# EAGLE board MotorPR (EAGLE 7.6.0)
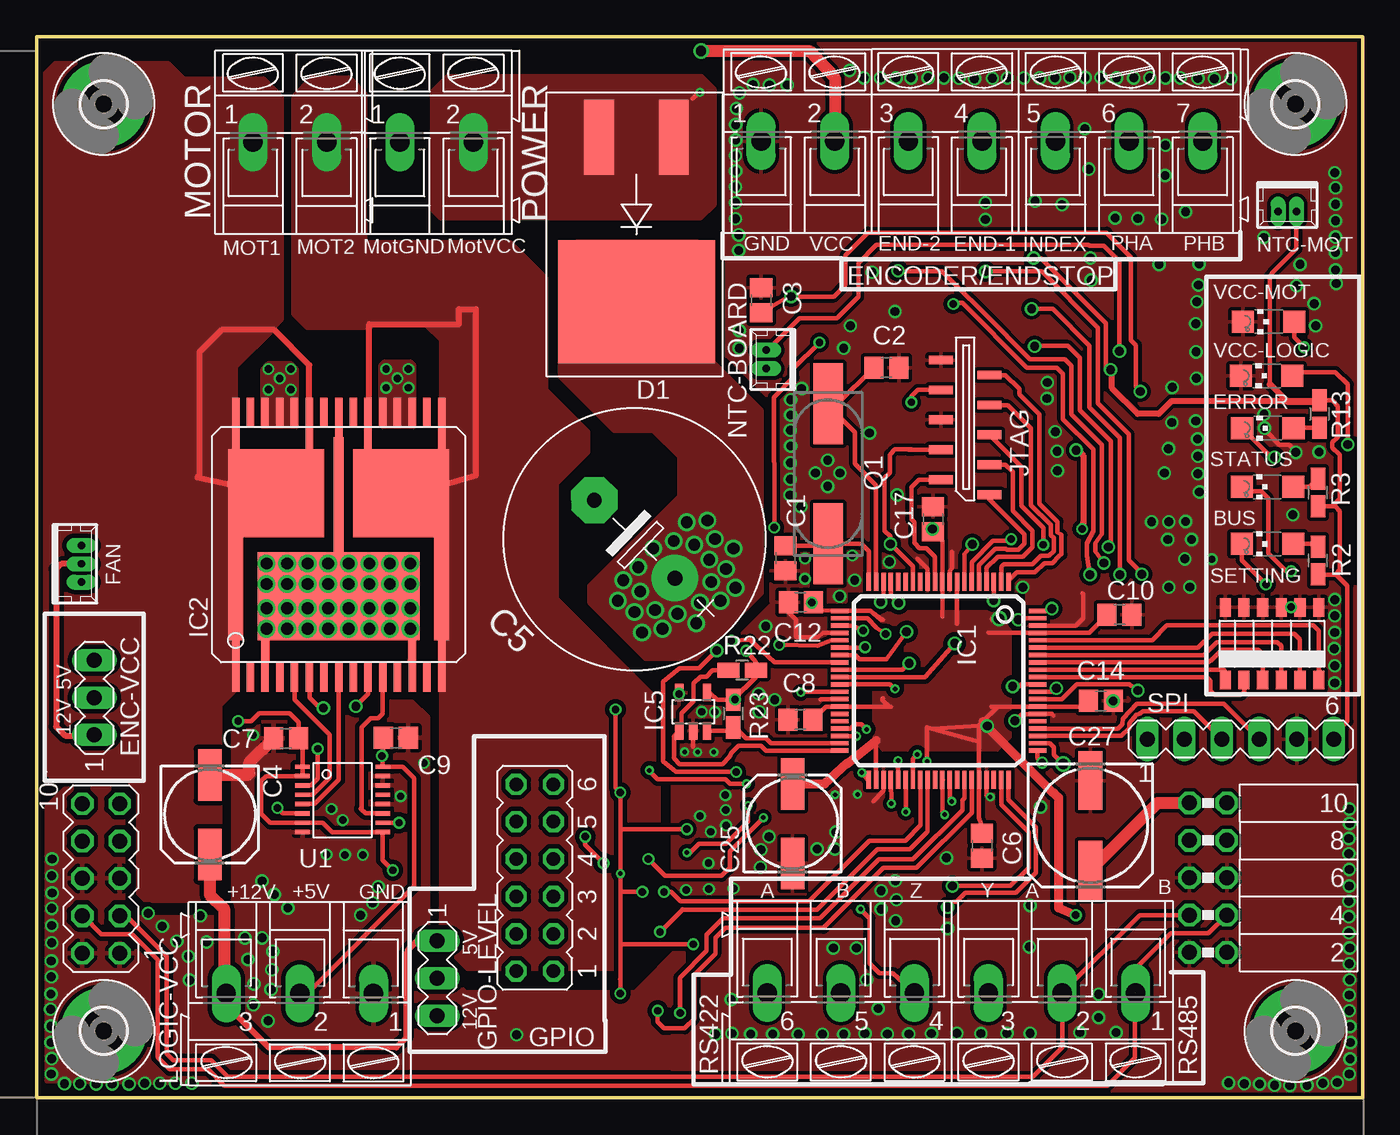
[diagram p6: board, top side]
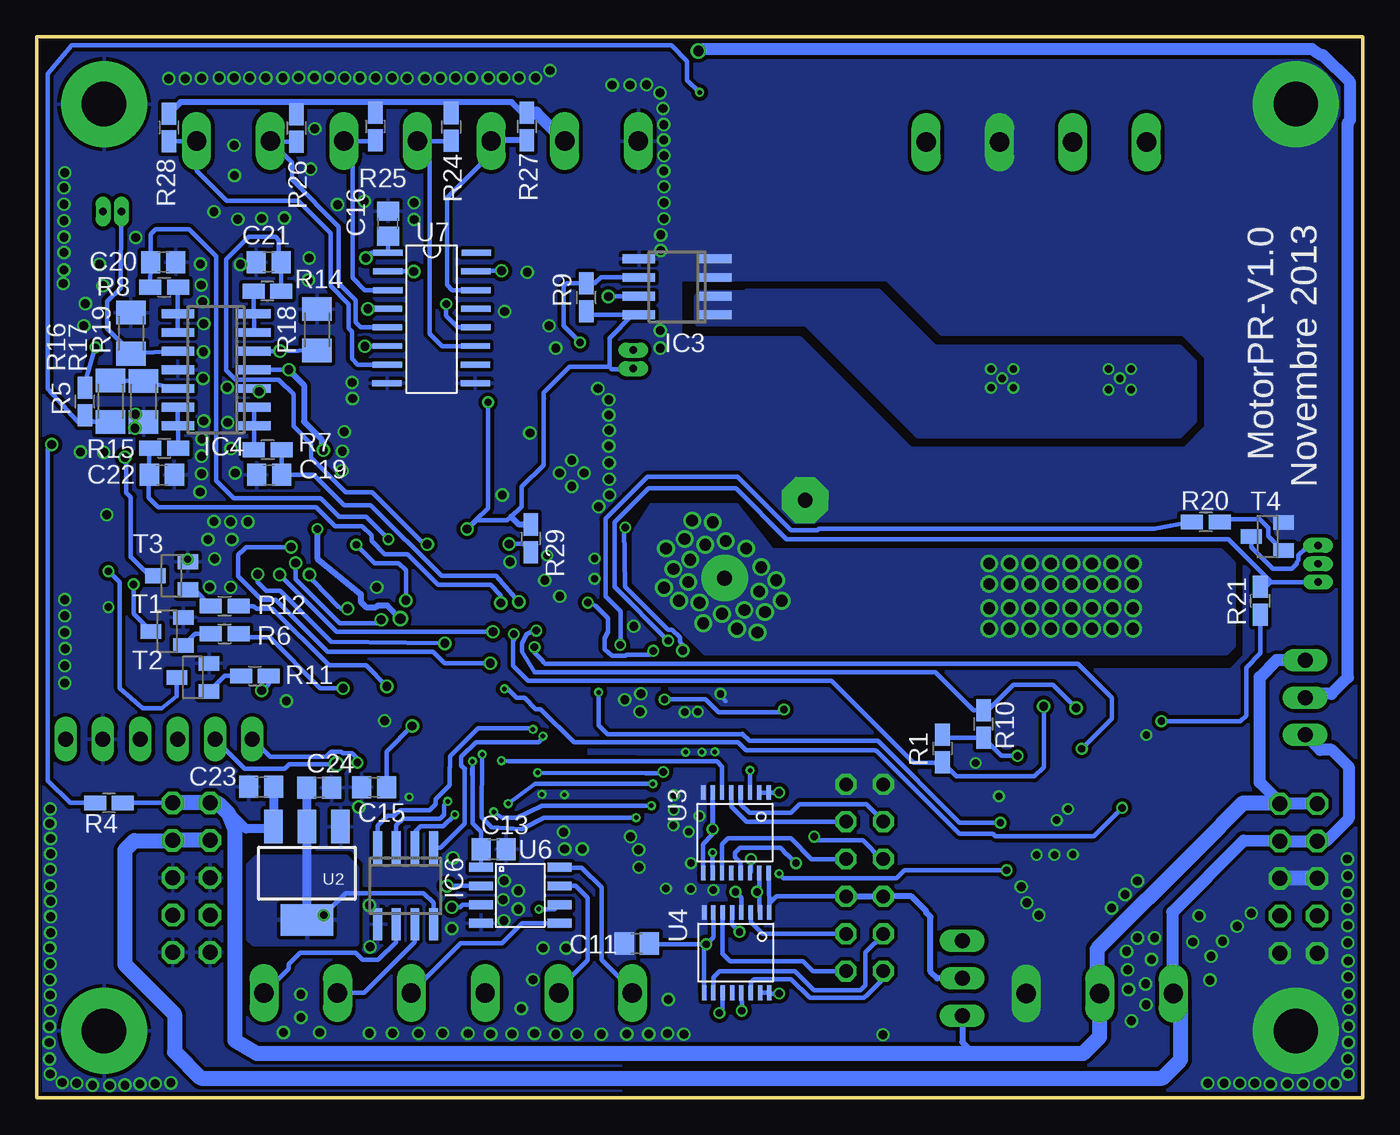
[diagram p7: board, bottom side, seen from below]

Size 90.14 x 72.11 mm. Coordinates in mm from the lower left corner, seen from the top.
Outline: 0,0 90.14,0 90.14,72.11 0,72.11 0,0
Copper layers (1*16): Top 0.035mm / dielectric 1.5mm / Bottom 0.035mm
Design rules "default": minimum track width 6mil, minimum drill 12mil, track to track 6mil, track to pad 6mil, pad to pad 6mil, via to via 6mil, smd to smd 0mil, copper to edge 10mil, drill to drill 10mil, minimum pad ring 10mil, minimum via ring 6mil, stop-mask expansion 2mil, vias tented up to drill 100mil, thermal gap 10mil

## Footprints (pad centres in the part's own frame; a part is rotated, then mirrored left to right if it is on the bottom)
MA05-2 = drill 1.016 octagon: 1 -5.08,-1.27; 2 -5.08,1.27; 3 -2.54,-1.27; 4 -2.54,1.27; 5 0,-1.27; 6 0,1.27; 7 2.54,-1.27; 8 2.54,1.27; 9 5.08,-1.27; 10 5.08,1.27
FE05-2W = drill 1.016 octagon: 1 -5.08,1.27; 2 -5.08,-1.27; 3 -2.54,1.27; 4 -2.54,-1.27; 5 0,1.27; 6 0,-1.27; 7 2.54,1.27; 8 2.54,-1.27; 9 5.08,1.27; 10 5.08,-1.27
CHIPLED_1206 = smd 1.5 x 1.5: A 0,-1.75; C 0,1.75
C0805 = smd 1.3 x 1.5: 1 -0.85,0; 2 0.85,0
153CLV-0605 = smd 3.5 x 1.6: + 2.7,0; - -2.7,0
E7,5-18 = drill 1.016 pad 3.15: + -3.81,0 | drill 1.016 pad 3.15 octagon: - 3.81,0
153CLV-0807 = smd 4 x 1.6: + 3.05,0; - -3.05,0
TO-263AB = smd 2.032 x 5.08: A1 -2.54,-3.556; A2 2.54,-3.556 | smd 10.668 x 8.382: K 0,7.62
MA03-1 = drill 1.016 long: 1 -2.54,0; 2 0,0; 3 2.54,0
AK300/7 = drill 1.321 long: 1 -15.011,0; 2 -10.008,0; 3 -5.004,0; 4 0,0; 5 5.004,0; 6 10.008,0; 7 15.011,0
53047-03 = drill 0.5 pad 0.698 long: 1 1.25,0.45; 2 0,0.45; 3 -1.25,0.45
JP6Q = drill 0.914 octagon: 1 -6.35,-1.27; 2 -6.35,1.27; 3 -3.81,-1.27; 4 -3.81,1.27; 5 -1.27,-1.27; 6 -1.27,1.27; 7 1.27,-1.27; 8 1.27,1.27; 9 3.81,-1.27; 10 3.81,1.27; 11 6.35,-1.27; 12 6.35,1.27
3,0-PAD = drill 3 pad 5.842: B3,0 0,0
LQFP80-12X12 = smd 1.2 x 0.3: 1 -6.725,4.75; 2 -6.725,4.25; 3 -6.725,3.75; 4 -6.725,3.25; 5 -6.725,2.75; 6 -6.725,2.25; 7 -6.725,1.75; 8 -6.725,1.25; 9 -6.725,0.75; 10 -6.725,0.25; 11 -6.725,-0.25; 12 -6.725,-0.75; 13 -6.725,-1.25; 14 -6.725,-1.75; 15 -6.725,-2.25; 16 -6.725,-2.75; 17 -6.725,-3.25; 18 -6.725,-3.75; 19 -6.725,-4.25; 20 -6.725,-4.75; 41 6.725,-4.75; 42 6.725,-4.25; 43 6.725,-3.75; 44 6.725,-3.25; 45 6.725,-2.75; 46 6.725,-2.25; 47 6.725,-1.75; 48 6.725,-1.25; 49 6.725,-0.75; 50 6.725,-0.25; 51 6.725,0.25; 52 6.725,0.75; 53 6.725,1.25; 54 6.725,1.75; 55 6.725,2.25; 56 6.725,2.75; 57 6.725,3.25; 58 6.725,3.75; 59 6.725,4.25; 60 6.725,4.75 | smd 0.3 x 1.2: 21 -4.75,-6.725; 22 -4.25,-6.725; 23 -3.75,-6.725; 24 -3.25,-6.725; 25 -2.75,-6.725; 26 -2.25,-6.725; 27 -1.75,-6.725; 28 -1.25,-6.725; 29 -0.75,-6.725; 30 -0.25,-6.725; 31 0.25,-6.725; 32 0.75,-6.725; 33 1.25,-6.725; 34 1.75,-6.725; 35 2.25,-6.725; 36 2.75,-6.725; 37 3.25,-6.725; 38 3.75,-6.725; 39 4.25,-6.725; 40 4.75,-6.725; 61 4.75,6.725; 62 4.25,6.725; 63 3.75,6.725; 64 3.25,6.725; 65 2.75,6.725; 66 2.25,6.725; 67 1.75,6.725; 68 1.25,6.725; 69 0.75,6.725; 70 0.25,6.725; 71 -0.25,6.725; 72 -0.75,6.725; 73 -1.25,6.725; 74 -1.75,6.725; 75 -2.25,6.725; 76 -2.75,6.725; 77 -3.25,6.725; 78 -3.75,6.725; 79 -4.25,6.725; 80 -4.75,6.725
MULTIPOWERSO-30 = smd 0.508 x 12: 1 -7,-4; 15 7,-4; 16 7,4; 30 -7,4 | smd 0.508 x 2: 2 -6,-9; 4 -4,-9; 5 -3,-9; 6 -2,-9; 7 -1,-9; 8 0,-9; 9 1,-9; 10 2,-9; 11 3,-9; 12 4,-9; 14 6,-9; 17 6,9; 18 5,9; 19 4,9; 20 3,9; 22 1,9; 24 -1,9; 26 -3,9; 27 -4,9; 28 -5,9; 29 -6,9 | smd 0.508 x 4: 3 -5,-8; 13 5,-8; 21 2,8; 23 0,8; 25 -2,8 | smd 6.5 x 6: OUTA -4.25,3.5; OUTB 4.25,3.5 | smd 1 x 7.5: OUTA@1 -7,-2.755; OUTB@1 7,-2.755 | smd 11 x 6: VCC 0,-3.5 | smd 0.65 x 8.3: VCC@1 0,3.145
SO08 = smd 0.6 x 2.2: 1 -1.905,-2.6; 2 -0.635,-2.6; 3 0.635,-2.6; 4 1.905,-2.6; 5 1.905,2.6; 6 0.635,2.6; 7 -0.635,2.6; 8 -1.905,2.6
SO14 = smd 0.6 x 2.2: 1 -3.81,-2.6; 2 -2.54,-2.6; 3 -1.27,-2.6; 4 0,-2.6; 5 1.27,-2.6; 6 2.54,-2.6; 7 3.81,-2.6; 8 3.81,2.6; 9 2.54,2.6; 10 1.27,2.6; 11 0,2.6; 12 -1.27,2.6; 13 -2.54,2.6; 14 -3.81,2.6
SOT23-5L = smd 0.55 x 1.2: 1 -0.95,-1.3; 2 0,-1.3; 3 0.95,-1.3; 4 0.95,1.3; 5 -0.95,1.3
SOIC8 = smd 0.6 x 2.2: 1 -1.905,-2.6; 2 -0.635,-2.6; 3 0.635,-2.6; 4 1.905,-2.6; 5 1.905,2.6; 6 0.635,2.6; 7 -0.635,2.6; 8 -1.905,2.6
MOLEX-52808-1070 = smd 0.6 x 1.65: 1 0,-1.524; 2 1.016,1.778; 3 2.032,-1.524; 4 3.048,1.778; 5 4.064,-1.524; 6 5.08,1.778; 7 6.096,-1.524; 8 7.112,1.778; 9 8.128,-1.524; 10 9.144,1.778
AK300/3 = drill 1.321 long: 1 -5.004,0; 2 0,0; 3 5.004,0
AK300/2 = drill 1.321 long: 1 -2.515,0; 2 2.489,0
53047-02 = drill 0.5 pad 0.698 long: 1 0.625,0.45; 2 -0.625,0.45
CSM-7X-DU = smd 5.5 x 2: 1 -4.75,0; 2 4.75,0
R0805W = smd 1.5 x 1: 1 -0.94,0; 2 0.94,0
M1206 = smd 1.6 x 2: 1 -1.4,0; 2 1.4,0
AK300/6 = drill 1.321 long: 1 -12.522,0; 2 -7.518,0; 3 -2.515,0; 4 2.515,0; 5 7.518,0; 6 12.522,0
DIP6-SMD = smd 1.27 x 0.76: 1 -2.159,3.175; 2 -2.159,1.905; 3 -2.159,0.635; 4 -2.159,-0.635; 5 -2.159,-1.905; 6 -2.159,-3.175; 7 2.759,-3.175; 8 2.759,-1.905; 9 2.759,-0.635; 10 2.759,0.635; 11 2.759,1.905; 12 2.759,3.175
MA06-1 = drill 1.016 long: 1 -6.35,0; 2 -3.81,0; 3 -1.27,0; 4 1.27,0; 5 3.81,0; 6 6.35,0
SOT23-BEC = smd 1 x 1.4: B -0.95,-1.1; C 0,1.1; E 0.95,-1.1
PW-PDSO-G16 = smd 0.3 x 1: 1 -2.159,-2.667; 2 -1.524,-2.667; 3 -0.889,-2.667; 4 -0.254,-2.667; 5 0.381,-2.667; 6 1.016,-2.667; 7 1.651,-2.667; 8 2.286,-2.667; 9 2.286,2.794; 10 1.651,2.794; 11 1.016,2.794; 12 0.381,2.794; 13 -0.254,2.794; 14 -0.889,2.794; 15 -1.524,2.794; 16 -2.159,2.794
SOT-223 = smd 1.27 x 2.286: 1 -2.286,-3.175; 2 0,-3.175; 3 2.286,-3.175 | smd 3.556 x 2.159: TER 0,3.175
R-PDSO-G8 = smd 0.6 x 1.65: 1 -2.032,-2.794; 2 -0.762,-2.794; 3 0.508,-2.794; 4 1.778,-2.794; 5 1.778,2.54; 6 0.508,2.54; 7 -0.762,2.54; 8 -2.032,2.54
PDSO-G16 = smd 2 x 0.4: 1 -3,4.5; 2 -3.01,3.23; 3 -3.01,1.96; 4 -3.02,0.69; 5 -3.03,-0.57; 6 -3.04,-1.84; 7 -3.05,-3.11; 8 -3.06,-4.38; 9 2.94,-4.38; 10 2.95,-3.11; 11 2.96,-1.84; 12 2.97,-0.57; 13 2.98,0.69; 14 2.99,1.96; 15 2.99,3.23; 16 3,4.5

## Placement (x,y rotation side)
B-B-L  [MA05-2]  4.37,14.91 90 top
B-B-R  [FE05-2W]  79.63,14.96 90 top
BUS  [CHIPLED_1206]  83.67,37.64 90 top
C1  22p  [C0805]  50.9,36.68 270 top
C2  22p  [C0805]  57.76,49.63 0 top
C3  10n  [C0805]  49.25,54.2 90 top
C4  22uF 16V  [153CLV-0605]  11.76,19.25 270 top
C5  1000uF 35V  [E7,5-18]  40.64,37.97 135.9 top
C6  100n  [C0805]  64.26,17.14 270 top
C7  100n  [C0805]  16.94,24.43 180 top
C8  100n  [C0805]  51.92,25.7 180 top
C9  100n  [C0805]  24.41,24.46 0 top
C10  100n  [C0805]  73.61,32.84 0 top
C11  100n  [C0805]  49.35,10.49 180 bottom
C12  100n  [C0805]  51.94,33.68 180 top
C13  100n  [C0805]  59.08,16.89 0 bottom
C14  100n  [C0805]  72.34,26.97 0 top
C15  100n  [C0805]  67.21,21.11 180 bottom
C16  100n  [C0805]  66.27,59.41 90 bottom
C17  100n  [C0805]  60.93,39.32 90 top
C19  100n  [C0805]  74.35,42.34 180 bottom
C20  1uF  [C0805]  81.56,56.79 0 bottom
C21  1uF  [C0805]  74.37,56.79 180 bottom
C22  1uF  [C0805]  81.64,42.34 0 bottom
C23  100n  [C0805]  74.88,21.13 180 bottom
C24  100n  [C0805]  70.94,21.08 0 bottom
C25  22uF 16V  [153CLV-0605]  51.38,18.64 90 top
C27  100uF 25V  [153CLV-0807]  71.63,18.52 270 top
D1  VBT4045BP  [TO-263AB]  40.77,61.72 180 top
ENC-VCC  [MA03-1]  3.91,27.2 90 top
ENCODER/ENDSTOP  [AK300/7]  64.26,65.02 0 top
ERROR  [CHIPLED_1206]  83.69,45.52 90 top
FAN  53047-03  [53047-03]  2.59,36.3 270 top
GPIO  [JP6Q]  33.86,14.96 90 top
GPIO-LEVEL  [MA03-1]  27.23,8.13 270 top
H1  [3,0-PAD]  4.55,4.55 0 top
H2  [3,0-PAD]  85.57,4.55 0 top
H3  [3,0-PAD]  85.57,67.54 0 top
H4  [3,0-PAD]  4.55,67.54 0 top
IC1  LPC1751  [LQFP80-12X12]  61.32,28.35 270 top
IC2  VNH3SP30  [MULTIPOWERSO-30]  20.52,37.59 0 top
IC3  ACS711ELCTR-25AB-T  [SO08]  46.61,55.12 90 bottom
IC4  LM324D  [SO14]  77.95,49.48 90 bottom
IC5  24LC00OT  [SOT23-5L]  44.63,26.24 0 top
IC6  LTC485S  [SOIC8]  65.07,14.4 180 bottom
JTAG  MOLEX-52808-1070  [MOLEX-52808-1070]  63.25,41 90 top
LOGIC-VCC  [AK300/3]  17.88,7.09 180 top
MOTOR  [AK300/2]  17.22,64.95 0 top
NTC-BOARD  53047-02  [53047-02]  50.04,50.19 90 top
NTC-MOT  53047-02  [53047-02]  85.01,60.68 180 top
POWER  [AK300/2]  27.2,64.95 0 top
Q1  CSM-7X-DU  [CSM-7X-DU]  53.8,42.42 90 top
R1  10K  [R0805W]  28.57,23.75 270 bottom
R2  100  [R0805W]  87.1,36.53 90 top
R3  100  [R0805W]  87.1,41.15 90 top
R4  210  [R0805W]  85.24,20.04 180 bottom
R5  1.5K  [R0805W]  86.87,47.32 90 bottom
R6  12k  [R0805W]  77.37,31.55 0 bottom
R7  470  [R0805W]  74.45,44.04 180 bottom
R8  4,7k  [R0805W]  81.48,55.09 0 bottom
R9  4.7K  [R0805W]  52.78,54.41 90 bottom
R10  10K  [R0805W]  25.78,25.4 90 bottom
R11  12k  [R0805W]  75.31,28.68 0 bottom
R12  12k  [R0805W]  77.37,33.43 0 bottom
R13  100  [R0805W]  87.2,46.48 270 top
R14  4,7k  [R0805W]  74.47,54.81 180 bottom
R15  4,7k  [R0805W]  81.48,44.15 0 bottom
R16  10k  [M1206]  85.14,47.35 90 bottom
R17  1k  [M1206]  82.88,47.32 270 bottom
R18  4,7k  [M1206]  71.09,52.2 90 bottom
R19  4.7k  [M1206]  83.74,51.97 90 bottom
R20  10K  [R0805W]  10.67,39.14 180 bottom
R21  10K  [R0805W]  6.96,33.78 90 bottom
R22  4,7K  [R0805W]  47.96,29.06 180 top
R23  4,7K  [R0805W]  47.35,26.11 270 top
R24  10K  [R0805W]  61.98,65.99 270 bottom
R25  10K  [R0805W]  67.13,66.01 270 bottom
R26  10K  [R0805W]  72.49,65.91 270 bottom
R27  10K  [R0805W]  56.82,66.01 270 bottom
R28  10K  [R0805W]  81.15,65.94 270 bottom
R29  4,7k  [R0805W]  56.57,38.02 270 bottom
RS422  [AK300/6]  62.18,7.14 180 top
SETTING  SWS006  [DIP6-SMD]  83.97,31.17 270 top
SPI  [MA06-1]  81.84,24.38 0 top
STATUS  [CHIPLED_1206]  83.67,41.53 90 top
T1  [SOT23-BEC]  81.28,31.7 90 bottom
T2  [SOT23-BEC]  79.53,28.57 90 bottom
T3  [SOT23-BEC]  80.98,35.48 90 bottom
T4  [SOT23-BEC]  6.48,38.15 90 bottom
U1  CD40109B  [PW-PDSO-G16]  20.73,20.35 270 top
U2  AMS1117  [SOT-223]  71.78,15.27 180 bottom
U3  CD40109B  [PW-PDSO-G16]  42.55,18.08 180 bottom
U4  CD40109B  [PW-PDSO-G16]  42.49,9.93 180 bottom
U6  ISL83490IBZ  [R-PDSO-G8]  57.15,13.64 270 bottom
U7  MC14050B  [PDSO-G16]  63.27,52.93 0 bottom
VCC-LOGIC  [CHIPLED_1206]  83.62,49.07 90 top
VCC-MOT  [CHIPLED_1206]  83.74,52.76 90 top

## Tracks (layer width: path | path; a pad name or v marks a point on that pad's centre or on a via)
+3V3  (via drill 0.3, 0.5, 0.6, 0.7)
  Top 0.305: 52.79,33.15 IC1.21 56.59,33.1 | C8.1 53.66,26.6 IC1.34 56.14,26.6 57.25,26.59 57.96,26.59 | 56.59,33.1 | 56.59,33.1 56.69,33.1 | 56.69,33.1 57.53,32.49 57.33,32.59 57.38,32.54 | IC1.42 57.07,24.28 | 64.07,24.2 IC1.56 64.07,19.04 64.49,17.86 64.36,17.89 C6.1 | 64.07,24.2 60.85,25.08 | 60.85,25.08 60.53,25.2 v60.53,22.86 | 64.07,24.2 64.07,25.33 64.33,25.59 65.33,26.59 IC1.67 | IC1.67 64.89,26.6 | 64.69,31.6 IC1.77 71.55,31.6 72.8,32.84 | 56.69,33.1 57.4,32.49 | IC1.8 62.56,32.23 | 61.57,32.69 IC1.10 61.57,37.88 60.91,38.53 60.91,38.58 | 60.91,38.58 61.24,38.91 60.83,38.73 v60.88,38.66 | 60.91,38.58 60.88,38.56 | 72.8,32.84 72.8,32.79 | C10.1 72.8,32.84 | v64.62,25.27 64.03,25.27 60.85,25.08 | v67.77,57.07 68.28,57.07 72.69,52.65 72.69,49.66 v73,49.48 | C17.1 60.94,38.58 60.88,38.63 60.88,38.61 60.91,38.58 | 60.96,38.53 60.91,38.58 | IC5.4 45.74,27.54 46.23,27.05 R23.1 | R23.1 | R23.1 47.35,27.13 | R22.1 48.9,28.6 R23.1 | R23.1 47.35,27.08 48.9,28.63 48.9,29.62 v48.23,30.38 | v52.68,33.66 v52.68,33.67 C12.1 | NTC-MOT.2 85.64,57.7 83.97,56.03 83.97,55.98 83.82,55.83 83.82,48.49 85.06,47.24 87.02,47.24 R13.1 87.22,47.4 88.06,47.4 88.44,47.02 88.44,44.91 88.09,44.55 88.09,44.2 88.57,43.71 88.57,40.72 88.06,40.21 R3.1 88.27,40.21 88.59,39.88 88.59,35.89 88.27,35.56 | IC1.67 71.16,26.6 C14.1 | SPI.6 88.19,24.66 89.1,25.58 89.1,34.8 88.34,35.56 88.27,35.56 | 88.27,35.56 87.15,35.56 87.12,35.59 | 87.12,35.59 87.1,35.61 87.02,35.61 86.97,35.66 | R2.1 87.12,35.59 | 87.12,35.59 | 39.67,18.21 v39.67,20.75 39.34,21.08 v39.34,26.39 | 39.67,18.21 v39.67,15.24 39.67,13.99 | 39.67,13.99 39.67,10.54 | 39.67,10.54 39.67,8.1
  Top 0.305: 39.67,8.1 39.65,8.08 | v44.2,18.26 39.73,18.26 39.67,18.21 | 39.67,8.1 v39.67,7.09 | v44.63,10.44 39.78,10.44 39.67,10.54 | v41.17,13.99 39.67,13.99 | v13.69,25.6 14.58,25.6 15.11,26.14 17.2,26.14 17.8,25.53 17.8,24.45 C7.1 | 17.63,24.6 C7.1 | C7.1 18.06,24.17 U1.1 U1.2 15.6,21.87 15.27,21.54 15.27,19.3 15.88,18.69 U1.7 19.43,18.69 20.07,18.06 U1.9 23.52,16.15 v24.21,15.47 | v59.46,47.27 59.46,47.68 59.89,48.11 61.34,48.11 61.39,48.06 61.42,48.06 JTAG.8 | 57.96,26.59 57.51,27.03 57.51,27.13 57.53,27.15 | 57.96,26.59 58.06,26.59 | R23.1 47.45,27.05 v47.47,27.08
  Top 0.406: C12.1 52.81,33.69 52.81,33.71 52.86,33.66 52.86,33.6 52.87,33.6 52.79,33.15 | v70.66,44.02 71.02,43.79 71.14,43.66 71.14,39.12 v71.07,38.66 | v65.43,32.56 65.05,32.49 65,32.54 | 83.82,48.49 83.84,48.49 85.04,47.3 87.3,47.3 87.38,47.22 86.97,47.22 86.84,47.35 77.14,47.35 76.28,46.48 74.85,46.48 73.1,48.23 73.1,49.38 v73,49.48
  Top 0.61: C25.+ 53.55,21.34 55.12,22.76 55.12,22.72 57.07,24.28 | 64.33,25.59 64.33,25.44 64.38,25.44 69.11,20.7 69.16,20.7 69.47,20.4 69.47,12.9 v70.64,12.42
  Bottom 0.305: R9.1 52.53,53.21 IC3.8 49.63,53.21 51.21,51.64 51.21,49.68 | R9.1 52.78,53.07 | 51.21,49.68 51.05,49.53 49.62,49.53 NTC-BOARD.2 | R9.1 52.78,53.42 52.73,53.37 | 51.21,49.68 53.92,49.68 55.7,47.9 55.7,47.55 | 55.7,47.55 55.7,43 57.17,41.53 57.17,40.16 57.89,39.5 58.17,39.24 60.3,39.24 | 60.3,39.24 60.33,39.24 v60.88,38.66 | C15.1 66.36,23.53 v64.62,25.27 | 71.68,14.66 71.78,14.55 | U6.1 59.94,16.88 C13.1 59.93,18.07 60.53,18.67 60.53,22.73 60.55,21.97 v60.53,22.86 | v67.77,57.07 67.41,57.43 U7.1 C16.1 | v48.23,30.38 48.46,30.1 50.06,30.1 50.11,30.05 51.03,30.05 51.54,30.48 51.54,31.19 51.31,31.7 51.31,32.59 52.17,33.45 52.45,33.63 52.7,33.76 v52.68,33.66 | R21.1 6.96,30.2 7.92,29.23 7.92,25.98 8.31,25.6 v13.69,25.6 | IC4.4 v73,49.48 | 55.65,47.52 55.68,47.52 55.7,47.55 | U3.15 41.02,12.65 U4.2 40.97,12.65 41,12.68 41,13.82 v41.17,13.99 | U3.9 44.86,15.27 44.86,17.25 44.2,17.91 v44.2,18.26 U3.7 44.2,20.14 44.17,20.12 44.17,18.39 44.4,18.16 | 40.97,7.11 40.95,7.11 U4.15 U4.16 40.28,7.09 v39.67,7.09 | v39.67,20.75 U3.1 U3.2 | U4.9 44.78,10.29 v44.63,10.44 | U4.7 44.15,10.92 v44.63,10.44 | v44.63,10.44 48.45,10.44 C11.1 | v59.46,47.27 59.46,40.08 60.3,39.24 | 60.3,39.24 60.3,39.19 60.81,38.68 | v24.21,15.47 31.17,15.47 31.7,14.94 39.37,14.94 v39.67,15.24 | v47.47,27.08 44.68,27.08 43.81,26.21 39.52,26.21 v39.34,26.39 | IC6.8 63.17,13.26 63.83,13.92 69.14,13.92 v70.64,12.42
  Bottom 0.406: C24.1 71.79,20.03 71.83,19.99 | v73,49.48 73,49.45 71.98,48.44 71.98,45.95 70.79,44.76 70.79,44.22 v70.66,44.02 | v71.07,38.66 71.07,36.65 68.12,34.24 68.12,33.73 67.74,33.35 67.08,33.35 66.95,33.48 66.32,33.48 v65.43,32.56 | U2.TER 71.27,12.09 71.09,11.91 71.09,11.94 71.17,12.01 | R29.1 57.35,38.96 57.89,39.5
  Bottom 0.61: C24.1 U2.2 71.78,14.55 U2.TER | v70.64,12.42 70.56,12.47 71.09,11.94 71.12,11.91
  pour Top (isolate 0.305): 57.02,24.28 57.02,32.18 57.81,32.97 65.38,32.97 66.07,32.28 66.07,24.54 65.25,23.72 57.58,23.72
  pour Bottom: 68.38,10.49 68.38,15.65 69.11,16.38 75.21,16.38 75.77,15.82 75.77,10.79 75.41,10.44 68.43,10.44
+5V  (via drill 0.5)
  Top 0.305: v23.47,23.24 23.56,23.33 C9.1 23.52,24.42 U1.16 24.87,22.5 25.65,21.72 25.65,14.38 18.36,7.09 LOGIC-VCC.2
  Top 0.813: B-B-R.9 76.2,20.04 C27.+
  Bottom 0.305: R10.1 28.35,24.46 R1.1 | 25.73,24.51 R10.1 | 26.67,3.05 26.7,3.02 | 26.77,3.33 26.47,3.02 | 84.28,20.02 R4.1 B-B-R.10 | 77.44,19.81 77.55,19.81 77.57,19.79 | v23.47,23.24 24.56,23.24 R10.1 | 17.98,6.99 LOGIC-VCC.2
  Bottom 0.406: 41.25,3.15 41.12,3.02 | GPIO-LEVEL.3 27.23,3.79 26.77,3.33
  Bottom 0.61: 41.91,3.1 41.99,3.02 | C23.1 74.03,18.4 | 74.03,18.4 74.03,18.32 74.07,18.29 75.92,18.29 77.44,19.81 | 74.03,18.4 U2.3
  Bottom 0.813: 5.61,20.04 7.01,21.44 7.01,28.6 5.87,29.74 ENC-VCC.3 | B-B-L.10 5.56,19.99 5.61,20.04 | B-B-L.9 5.64,20.02 5.61,20.04
  Bottom 1.016: 17.98,6.99 18.06,7.06 18.06,10.08 11.23,16.92 11.23,16.94 8.13,20.04 5.69,20.04 B-B-L.9 | LOGIC-VCC.2 17.88,4.14 19,3.02 26.47,3.02 26.7,3.02 41.12,3.02 41.99,3.02 75.18,3.02 76.68,3.91 76.68,18.26 77.09,19.28 77.09,19.3 77.57,19.79 77.8,20.02 78.33,20.02 B-B-R.9 B-B-R.10
+12V
  Top 0.406: GPIO-LEVEL.1 25.86,10.67 25.22,10.03 25.22,9.91 25.09,9.78 25.09,4.09 24.43,3.43 15.77,3.43 12.5,6.71 LOGIC-VCC.3 | FAN.2 1.68,36.3 1.32,35.94 1.32,25.22 1.93,24.61 3.83,24.61 3.86,24.59 3.91,24.64 ENC-VCC.1
  Top 0.813: LOGIC-VCC.3 12.72,7.24 12.72,12.85 11.76,13.82 C4.+
  Bottom 0.813: LOGIC-VCC.3 12.95,7.16 12.95,12.62 8.1,17.48 B-B-L.7 B-B-L.8 2.49,17.45 0.96,18.97 0.96,22.5 2.11,23.65 2.9,23.65 ENC-VCC.1
  Bottom 1.016: LOGIC-VCC.3 12.37,6.58 12.37,2.59 13.61,1.35 78.99,1.35 80.77,3.12 80.77,5.69 84.15,9.07 84.15,16.84 83.52,17.48 80.97,17.48 | 80.97,17.48 80.9,17.48 80.87,17.5 | B-B-R.7 B-B-R.8 80.95,17.5 80.97,17.48
+24V  (via drill 0.8)
  Top 0.406: v25.4,31.88 25.4,29.71 IC2.13 | v15.62,31.88 15.62,29.69 IC2.3 | v21.21,33.27 21.21,33.41 IC2.VCC | v19.81,36.32 19.94,36.32 20.57,36.96 20.57,37.59 | 20.57,37.59 20.57,45.54 IC2.23 | IC2.VCC@1 20.52,37.64 20.57,37.59
  other vias: 45.72,36.58 42.55,31.88 41.91,37.34 43.31,37.85 44.2,39.12 46.48,33.78 25.4,36.32 24,33.27 25.4,33.27 25.4,34.92 24,31.88 22.61,31.88 21.21,31.88 19.81,31.88 19.81,33.27 22.61,33.27 24,34.92 24,36.32 22.61,36.32 22.61,34.92 21.21,34.92 21.21,36.32 19.81,34.92 18.41,34.92 18.41,31.88 18.41,33.27 17.02,31.88 17.02,33.27 17.02,34.92 17.02,36.32 18.41,36.32 15.62,36.32 15.62,34.92 15.62,33.27 46.1,37.97 44.7,37.59 40.89,36.07 41.02,34.42 42.04,33.15 45.85,35.05 44.83,32.26 46.86,35.94 45.09,33.66 43.56,32.89 40.64,33.02 39.88,35.18 47.5,34.67 47.37,37.34 45.59,39.24 41.15,31.62 39.5,33.78
  pour Bottom (no thermals): 9.27,30.23 44.7,30.23 49.53,35.05 49.53,38.48 48.39,40.26 42.55,40.26 40.13,37.21 9.65,37.21 8.76,36.32 8.76,30.73
  pour Top (no thermals): 35.56,49.02 35.56,57.02 36.7,58.17 44.96,58.17 45.97,57.15 45.97,50.04 49.28,46.74 49.28,34.29 44.83,29.84 41.4,29.84 37.59,33.66 37.59,34.8 43.69,40.89 43.69,43.56 41.91,45.34 39.24,45.34
CLK_EEPROM
  Top 0.305: IC1.40 49.58,23.6 49.25,23.93 47.7,23.93 47.24,23.47 47.09,23.16 46.61,22.68 43.69,22.68 43.31,23.06 43.31,24.57 IC5.1 43.84,25.1 43.84,26.14 44.65,26.95 44.65,28.17 45.11,28.63 45.52,28.63 45.95,29.06 R22.2 47.04,29.06
DE-RS485  (via drill 0.3)
  Top 0.305: v62.2,20.14 62.2,20.17 62.08,20.3 62.08,21.59 62.05,21.61 IC1.52
  Bottom 0.305: IC6.3 65.71,18.52 65.25,18.97 62.74,18.97 62.46,19.25 62.46,19.89 v62.2,20.14
DIAGA  (via drill 0.5, 0.6)
  Top 0.305: v19.48,26.49 19.25,26.49 18.54,27.2 18.54,28.57 IC2.6 | v56.19,31.75 55.42,32.08 54.62,32.1 IC1.23
  Bottom 0.305: v19.48,26.49 21.06,28.07 23.75,28.07 25.48,26.34 R10.2 26.47,26.34 29.06,28.93 56.31,28.93 57.15,30.3 57.15,30.91 56.84,31.5 56.36,31.75 v56.19,31.75
DIAGB  (via drill 0.5, 0.6)
  Top 0.305: IC2.10 22.52,27.45 v21.69,26.62 | IC1.22 56.46,32.6 57.1,31.95 57.63,31.57 v57.71,31.52
  Bottom 0.305: v21.69,26.62 21.69,22.48 22.33,21.84 27.61,21.84 R1.2 28.6,22.81 28.63,22.78 | v57.71,31.52 57.68,31.14 57.76,31.06 57.76,29.36 56.74,28.35 36.12,28.35 30.56,22.78 28.63,22.78 | 28.63,22.78 28.47,22.78 28.45,22.81
DIP1
  Top 0.305: IC1.76 75.83,31.1 76.83,32.11 86.79,32.11 87.15,31.75 87.15,29.08 87.22,29.01 SETTING.12
DIP2
  Top 0.305: SETTING.11 85.88,31.17 85.5,31.55 79.91,31.55 78.94,30.58 68.03,30.58 | 68.02,30.58 68.03,30.58 | 68.03,30.58 IC1.75
DIP3
  Top 0.305: IC1.74 79.35,30.1 80.21,30.96 84.35,30.96 84.61,30.71 SETTING.10
DIP4
  Top 0.305: SETTING.9 83.34,30.18 83.06,30.45 80.57,30.45 79.83,29.72 79.76,29.72 79.65,29.62 68.06,29.62 IC1.73
DIP5
  Top 0.305: IC1.72 80.68,29.1 80.75,29.03 80.75,29.01 SETTING.7
DIP6
  Top 0.305: IC1.71 79.53,28.6 79.78,28.35 79.78,27.66 80.06,27.38 81.86,27.38 82.09,27.61 82.09,28.38 SETTING.8
ENC_INDEX
  Bottom 0.305: U7.3 67.85,54.89 68.68,55.73 68.68,64.44 ENCODER/ENDSTOP.5 67.18,65.02 R25.2
ENC_PHA
  Bottom 0.305: U7.5 68.11,52.36 68.45,52.7 68.45,54.2 69.62,55.37 69.62,59.21 72.8,62.38 72.8,63.55 ENCODER/ENDSTOP.6 74.27,64.97 | R26.2 74.27,64.97 | 74.27,64.97 74.32,65.02
ENC_PHB
  Bottom 0.305: U7.7 68.31,49.82 68.71,50.22 68.71,52.07 68.94,52.3 68.94,53.95 70.18,55.19 70.18,58.78 72.36,60.96 77.24,60.96 79.27,62.99 ENCODER/ENDSTOP.7 81.13,65.02 R28.2
ENDSTOP1
  Bottom 0.305: U7.11 62.6,51.09 63.45,51.94 63.45,64.21 ENCODER/ENDSTOP.4 62,65.02 R24.2
ENDSTOP1_  (via drill 0.5, 0.6)
  Top 0.305: v71.6,35.56 71.37,36.88 71.37,37.69 71.83,38.51 71.83,44.07 69.77,46.13 69.77,49.23 69.37,49.63 67.31,49.63 62.92,54.03 62.38,54.03 v62.31,53.95 | IC1.80 68.86,33.1 v69.01,33.25
  Bottom 0.305: 60.31,52.38 U7.12 60.29,52.38 | v69.01,33.25 69.44,33.25 69.62,33.38 69.65,33.38 71.27,35.08 71.68,35.51 71.65,35.53 v71.6,35.56 | v62.31,53.95 62.31,53.16 61.52,52.38 60.29,52.38 | 60.27,52.38 60.29,52.38
ENDSTOP2
  Bottom 0.305: U7.14 61.9,54.89 62.26,55.24 62.26,61.16 | ENCODER/ENDSTOP.3 59.26,64.16 62.26,61.16 | 62.28,61.14 62.26,61.16 | 62.26,61.16 62.26,61.19
  Bottom 0.406: R27.2 59.21,65.08 ENCODER/ENDSTOP.3
ENDSTOP2_  (via drill 0.6)
  Top 0.305: IC1.79 66.84,32.6 v66.73,32.49 | v72.54,36.35 72.47,36.42 71.96,37.13 71.96,37.69 72.42,38.33 72.42,44.37 70.33,46.46 70.33,49.76 69.9,50.19 67.51,50.19 66.45,51.26 65.43,52.3 61.54,56.19 58.57,56.19 v58.55,56.21
  Bottom 0.305: v66.73,32.49 66.8,32.49 67.03,32.26 69.55,32.26 72.54,35.26 v72.54,36.35 | v58.55,56.21 60.23,56.21 U7.15
GND  (via drill 0.3, 0.5, 0.6)
  Top 0.305: IC1.24 53.47,31.6 53.06,31.32 51.66,31.29 51.61,31.34 51.61,32.49 50.93,33.17 50.93,33.51 C12.2 | 60.55,35.07 IC1.12 60.57,35.95 59.87,36.65 | IC1.9 62.07,35.83 62.23,35.99 62.23,37.08 62.2,37.11 | IC1.57 64.57,20.55 64.72,20.4 64.75,20.4 | IC1.43 57.57,20.89 57.53,20.85 56.9,20.14 56.87,20.14 | 69.11,25.98 69,26.1 IC1.66 68.03,26.09 68.02,26.09 66.98,26.06 66.55,25.63 v66.5,25.63 | IC1.78 70.65,32.1 71.14,32.59 71.14,34.24 71.09,34.29 | v83.46,45.52 83.46,45.87 83.52,45.82 83.52,45.36 84.48,44.4 85.14,44.4 85.7,43.84 85.7,43.87 | SETTING.4 83.41,33.33 83.46,33.38 83.46,33.43 83.59,33.55 | IC1.33 53.31,27.1 53.26,27.05 | IC5.2 44.63,23.88
  Top 0.406: IC5.5 43.66,27.54 v43.66,27.46
  Top 0.813: C4.- 14.36,21.95 14.45,22.05 14.45,22.8 C7.2
  Bottom 0.305: C21.2 76,56.79 76.25,56.54 | 43.69,27.48 43.31,26.95
  Bottom 0.406: v43.66,27.46 43.69,27.46 43.69,27.48 IC5.5
  Bottom 1.016: B-B-L.6 B-B-L.5
  other vias: 49.56,32.05 49.23,16.87 49.2,15.67 53.06,16.92 54.25,16.92 54.33,18.06 49.78,17.75 85.65,55.19 86.84,53.98 86.94,52.48 87.17,43.89 85.6,43.87 85.39,39.62 76.66,42.47 76.94,44.12 51.23,43.15 51.26,44.3 51.23,45.36 51.26,46.41 51.99,48.21 53.77,41.55 51.23,42.04 52.93,42.47 53.77,43.33 51.21,40.97 54.61,42.47 55.45,36.86 55.6,35.18 54.58,34.09 78.94,43.61 78.94,42.42 79.02,56.67 76.3,56.64 78.97,55.24 78.87,54.1 85.88,56.64 83.44,46.46 49.12,26.24 50.16,27.05 68.25,19.76 89.23,19.63 89.26,18.64 89.2,17.63 89.2,16.59 89.23,15.52 89.23,14.4 89.2,13.36 89.2,12.32 89.2,11.23 89.26,10.19 89.23,9.12 89.26,8.03 89.23,6.99 89.23,5.92 89.28,4.85 89.31,3.76 89.28,2.64 89.23,1.63 88.42,1.04 87.43,0.99 86.36,0.86 85.19,0.84 84.15,0.86 83.13,0.94 82.09,0.97 81.03,1.02 88.24,28.19 88.24,29.36 88.21,30.53 88.24,31.62 88.24,32.77 88.24,33.86 88.34,55.35 88.29,56.26 88.29,57.45 88.29,58.5 88.29,59.61 88.29,60.73 88.29,61.85 88.24,62.87 81.18,69.27 80.06,69.27 78.94,69.29 77.75,69.32 76.73,69.32 75.67,69.32 74.57,69.32 73.41,69.32 72.34,69.34 71.27,69.34 70.23,69.34 69.22,69.32 68.17,69.32 67.11,69.32 65.99,69.32 64.97,69.29 63.75,69.27 62.71,69.29 61.67,69.32 60.6,69.32 59.44,69.32 58.42,69.32 57.35,69.32 56.24,69.32 55.24,69.82 71.63,57.07 71.68,55.58 73.3,59.79 74.85,59.77 76.48,59.72 78.11,60.22 68.71,48.62 68.68,47.52 69.24,45.26 78.11,39.17 76.96,39.14 75.79,39.14 54.15,10.19 55.73,10.19 47.22,6.68 61.93,11.51 52.22,35.28 52.22,36.65 85.27,33.35 79.88,36.6 73.18,26.97 51.03,68.83 49.81,68.83 48.69,68.86 47.78,68.3 47.57,67.23 47.52,66.14 47.52,65.1 47.5,64.03 47.52,62.99 47.5,61.93 47.5,60.83 47.5,59.74 47.73,58.65 47.73,57.58 47.75,52.15 47.75,50.95 51.26,47.45 51.94,40.18 1.04,16.23 1.02,15.09 1.04,13.92 1.02,12.88 1.02,11.71 1.02,10.54 0.99,9.3 0.99,8.23 0.97,7.06 0.94,6.02 0.97,4.88 0.97,3.76 1.02,2.67 0.99,1.63 1.88,0.97 2.92,0.97 4.04,0.94 5.13,0.94 6.27,0.94 7.34,0.99 8.36,0.99 9.42,0.99 10.54,0.99 15.32,14.73 16.15,13.82 17.07,12.9 22.02,12.42 22.83,13.26 23.22,14.35 32.61,4.29 46.15,4.32 47.27,4.37 48.54,4.34 50.04,4.34 51.77,4.32 53.42,4.32 54.86,4.32 56.31,4.37 57.84,4.34 59.28,4.34 60.83,4.37 62.56,4.39 64.19,4.37 65.96,4.39 67.54,4.39 56.79,56.11 58.34,53.44 55.32,52.48 54.86,50.95 56.62,45.19 58.5,40.97 57.96,36.42 69.37,43.94 69.39,42.62 78.05,36.63 76.89,37.95 78.51,37.95 79.04,41.17 77.19,48.29 77.17,45.9 83.41,58.47 78.79,52.6 78.84,48.9 78.82,50.7 78.92,44.78 78.79,46 78.38,34.72 76.96,34.7 67.03,34.7 64.49,60.83 64.49,59.69 67.87,60.93 69.7,60.71 71.25,65.86 71.53,63.12 76.73,64.74 76.71,62.69 7.57,12.55 11.13,12.37 8.53,11.66 9.53,10.64 10.31,9.63 10.39,8 11.56,10.59 14.15,10.87 15.32,10.87 16.05,9.96 14.35,9.4 14.76,7.75 14.73,6.32 15.72,5.23 15.93,7.37 15.98,8.71 19.71,16.54 20.95,16.51 22.17,16.51 24.74,20.5 26.31,22.76 14.71,24.66 44.15,14.12 45.67,15.95 45.69,14.2 46.81,20.57 46.84,19.56 46.86,18.52 45.82,18.08 45.09,19.15 20.04,19.63 20.8,18.87 49.07,27.46 45.21,26.24 46.1,26.21 72.19,7.04 70.92,4.45 73.38,4.45 72.19,5.46 47.37,14.22 61.85,16.31 64.82,20.45 44.04,23.52 44.93,23.5 46.02,23.5 54.28,20.6 55.8,20.62 58.37,14.76 57.4,14.07 57.4,12.83 58.39,12.04 58.45,13.46 56.41,8.03 57.2,6.07 67.49,10.26 67.54,13.08
  pour Top (isolate 0.305): 0.69,1.12 0.69,19.79 1.91,21.01 5.13,21.01 5.89,20.24 5.89,13.06 6.68,12.27 12.12,12.27 13.34,13.49 13.34,25.45 14.81,26.92 25.53,26.92 26.59,25.86 26.59,9.75 29.16,7.19 40.67,7.19 43.97,10.49 43.97,0.66 43.84,0.53
  pour Bottom (isolate 0.254, rank 4): 46.51,71.68 89.94,71.68 89.94,0.2 50.44,0.2 50.44,42.39 50.44,44.73 46.38,48.79 46.38,71.58 46.48,71.68
  pour Top (isolate 0.254): 89.94,0.23 43.23,0.23 43.23,27.25 43.64,27.25 49.86,33.48 54.97,33.48 54.97,22.45 67.34,22.45 67.34,33.6 67.31,33.6 67.31,34.75 89.94,34.75
  pour Top (isolate 0.254): 50.04,35.86 49.91,35.86 49.91,33.73 55.02,33.73 55.02,34.47 89.97,34.47 89.97,71.86 46.89,71.86 46.89,50.39 46.91,50.39 50.14,47.17 50.14,35.94 50.06,35.86
  pour Bottom (isolate 0.254, no thermals): 0.46,71.68 47.35,71.68 47.35,55.63 32.31,55.63 28.6,51.92 12.19,51.92 10.62,50.34 10.62,45.57 12.06,44.12 30.73,44.12 38.25,51.64 47.19,51.64 47.14,51.41 47.12,51.26 47.12,48.87 47.6,48.87 50.72,45.75 50.72,41.4 50.65,41.33 42.52,41.33 39.12,37.92 9.17,37.92 8,36.75 8,30 8.94,29.06 44.68,29.06 50.29,34.67 50.29,40.23 51,40.94 51.16,40.94 52.43,39.67 52.55,39.67 52.55,0.41 0.46,0.41
GND-MM  (via drill 0.5)
  other vias: 15.75,49.53 15.75,48.13 17.27,49.53 23.75,49.53 24.51,48.9 23.75,48.26 25.27,48.26 17.27,48.13 16.51,48.9 25.27,49.53
  pour Top (no thermals): 15.37,45.59 15.37,49.53 15.75,49.91 17.27,49.91 17.65,49.53 17.65,45.59
  pour Top (no thermals): 23.37,45.72 23.37,49.78 23.62,50.04 25.4,50.04 25.65,49.78 25.65,45.59 23.5,45.59
  pour Bottom (no thermals): 42.04,54.74 45.09,54.74 45.34,54.48 45.34,52.7 45.21,52.58 37.85,52.58 30.23,44.96 12.45,44.96 11.43,45.97 11.43,50.04 12.45,51.05 29.08,51.05 32.89,54.86 41.91,54.86
I_FAULT  (via drill 0.3, 0.5, 0.6)
  Top 0.305: IC1.41 56.46,21.62 v56.08,22.1 | v50.14,38.76 50.11,47.62 51.46,48.97 51.46,49.58 v53.21,51.33 | v47.55,22.15 43.46,22.15 42.57,22.89 42.57,28.27 43.69,29.18 45.03,29.18 46.25,30.4 v46.23,30.4 | v47.55,22.15 47.52,22.12 47.5,22.17 | 47.5,22.17 47.5,22.15 | v47.55,22.15 47.5,22.17
  Bottom 0.305: IC3.6 51.49,55.75 51.51,55.78 51.79,55.78 52.22,55.35 52.63,55.35 52.76,55.47 52.76,55.37 R9.2 | v56.08,22.1 48.79,22.07 47.6,22.07 v47.55,22.15 | v46.23,30.4 46.23,30.79 46.43,30.99 46.43,31.29 46.97,31.83 47.24,31.83 50.14,34.72 50.22,38.73 v50.14,38.76 | v53.21,51.33 53.21,51.36 54.33,52.48 54.33,55.14 54.13,55.35 R9.2 | R9.2
I_SENSE  (via drill 0.6)
  Top 0.305: v57.38,33.71 57.4,33.68 57.56,34.11 57.56,35.06 IC1.18
  Bottom 0.305: 73.51,42.35 71.31,42.35 69.24,40.28 67.44,40.28 62.64,35.48 58.9,35.48 v57.38,33.71 | R7.1 73.51,42.35 | 73.51,42.35 C19.1
IN1
  Bottom 0.305: GPIO.2 32.59,8.1 33.78,6.91 33.81,6.91 33.91,6.81 37.59,6.81 38.86,8.08 41.38,8.08 41.6,7.85 U4.14
IN2
  Bottom 0.305: GPIO.4 32.59,11.1 33.81,9.88 33.81,7.64 34.14,7.32 37.31,7.32 38.61,8.61 43.74,8.61 44.15,8.2 U4.10
IN3
  Bottom 0.305: GPIO.1 37.39,8.61 38.05,9.27 43,9.27 43.51,9.78 U4.6
IN4
  Bottom 0.305: GPIO.3 40.82,11.15 41.6,11.94 U4.3
IN24V  (via drill 0.3)
  Top 0.305: v45.09,68.33 45.01,68.33 44.58,67.89
  Bottom 0.305: 86.87,46.46 86.36,45.95 R16.1 87.35,45.95 89.41,48.18 89.41,69.6 87.76,71.53 46.99,71.53 45.92,70.46 45.92,69.16 v45.09,68.33 | R5.1 86.87,46.46 | 86.87,46.46 86.89,46.48
  pour Top (isolate 0.305, no thermals): 27.46,59.77 45.14,59.77 46.08,60.71 46.08,68.55 45.19,69.44 27.94,69.44 26.87,68.38 26.87,60.35
IN_1  (via drill 0.5)
  Top 0.305: IC1.55 63.57,19.37 59.82,15.62 57.56,15.62 53.49,11.56 46.81,11.56 46.13,10.87 46.13,9.78 44.7,8.36 44.7,5.38 44.04,4.72 42.65,4.72 42.22,5.16 v42.22,5.92
  Bottom 0.305: v42.22,5.92 42.22,6.55 42.24,6.58 U4.13
IN_2  (via drill 0.5)
  Top 0.305: IC1.54 63.07,20.37 62.92,20.22 62.92,19.56 59.56,16.2 57.25,16.2 53.24,12.19 48.49,12.19 48.46,12.19 48.44,12.19 46.66,12.19 45.54,11.07 45.54,9.98 43.74,8.18 v43.74,5.77
  Bottom 0.305: U4.11 43.51,5.99 v43.74,5.77
IN_3  (via drill 0.5)
  Top 0.305: IC1.49 60.57,18.1 59.36,16.89 57.15,16.89 53.03,12.78 43.89,12.78 | v42.37,11.28 42.39,11.28 43.87,12.75 | 43.89,12.8 43.89,12.78 | 43.89,12.78 43.87,12.75 | 43.87,12.75 43.89,12.75 43.89,12.78 | 43.89,12.78 43.87,12.78
  Bottom 0.305: U4.5 42.88,11.79 v42.37,11.28
IN_4  (via drill 0.5)
  Top 0.305: IC1.48 60.07,18.52 59.05,17.48 56.62,17.48 52.5,13.36 43.76,13.36 43.13,13.99 v42.65,13.99
  Bottom 0.305: U4.4 42.24,13.59 v42.65,13.99
INA
  Top 0.305: U1.4 18.77,20.6 19.91,21.74 19.91,24.66 17.53,27.05 IC2.5
INA-3V3  (via drill 0.5)
  Top 0.305: IC1.26 56.28,30.6 v56.31,30.63 | v19.1,23.72 19.1,21.69 18.67,21.26 18.09,21.26 U1.3
  Bottom 0.305: v56.31,30.63 56.31,30.25 55.73,29.67 55.73,29.62 55.6,29.49 19.38,29.49 17.07,27.18 17.07,25.76 v19.1,23.72
INB
  Top 0.305: U1.11 22.35,19.33 22.02,19.66 22.07,19.71 22.07,25.17 22.71,25.81 23.22,25.81 23.52,26.11 IC2.11
INB-3V3  (via drill 0.3, 0.5)
  Top 0.305: U1.10 v24.64,18.69 | IC1.32 54.58,27.58 52.15,27.58 v51.94,27.56
  Bottom 0.305: v24.64,18.69 27.41,18.69 32.97,24.26 41.71,24.26 42.19,24.74 42.19,24.71 | v51.94,27.56 51.94,25.32 51.33,24.71 42.19,24.71 | 42.19,24.71 42.16,24.74
INDEX  (via drill 0.6)
  Top 0.305: IC1.30 60.4,28.6 v62.41,30.89 | v75.13,35.59 75.13,35.64 74.24,36.52 74.24,45.11 72.14,47.22 72.14,52.35 68.33,56.16 v64.52,56.16
  Bottom 0.305: v62.41,30.89 70.13,30.99 73.61,34.47 74.55,34.47 75.13,35.05 v75.13,35.59 | v64.52,56.16 U7.2
LED-BUS  (via drill 0.6)
  Top 0.305: IC1.69 69,27.6 v69.32,27.84
  Bottom 0.305: v69.32,27.84 70.87,27.84 74.32,31.29 76.17,31.29 R6.2
LED-ERROR  (via drill 0.6)
  Top 0.305: v66.34,27.96 66.8,27.96 66.93,28.09 IC1.70
  Bottom 0.305: v66.34,27.96 67.77,29.39 70.28,29.39 74.14,33.25 75.21,33.25 75.39,33.43 R12.2
LED-STATUS  (via drill 0.6)
  Top 0.305: IC1.68 68.92,27.1 68.94,27.08 69.7,27.08 70.71,28.09 74.27,28.09 | 74.27,28.09 74.4,27.99 | 74.27,28.09 v74.85,27.69 74.42,27.99
  Bottom 0.305: R11.2 74.4,28.12 74.45,28.02 v74.85,27.69
MOTOR-1
  Top 0.406: IC2.25 18.52,49.8 16.13,52.2 12.57,52.2 11.05,50.67 11.05,42.29 10.92,42.16 16.26,41.02 16.26,41.15 16.38,41.15
  pour Top (isolate 0.305, no thermals): 0.41,25.55 0.41,22.35 0.94,21.82 5.97,21.82 6.91,20.88 6.91,13.89 7.39,13.41 11.51,13.41 12.47,14.38 12.47,26.67 13.54,27.74 13.54,49.68 16.1,52.25 16.1,52.35 16.66,52.91 16.66,68.02 15.42,69.27 9.98,69.27 8.94,70.31 1.24,70.31 0.41,69.47
MOTOR-2
  Top 0.406: IC2.21 22.61,45.59 22.61,52.58 28.7,52.58 28.7,53.59 29.84,53.59 29.84,42.29 IC2.16
  pour Top (isolate 0.305, no thermals): 22.63,52.32 18.39,52.32 17.45,53.26 17.45,68.07 18.69,69.32 21.26,69.32 22.33,68.25 22.3,60.83 22.33,58.17 32.18,58.14 34.62,55.7 34.62,48.11 37.47,45.26 37.47,43.87 35.33,41.73 35.33,33.91 42.27,26.97 42.27,10.54 40.49,8.76 29.29,8.76 27.48,10.57 27.48,51.51 26.42,52.58 22.89,52.58
N$1
  Top 0.305: IC1.19 57.07,41.64 55.63,43.08 55.63,45.24 53.75,47.12 | Q1.2 54.45,47.17 C2.1
  Top 0.406: 53.75,47.12 53.8,47.12 Q1.2
N$2  (via drill 0.5)
  Top 0.305: IC1.61 68.04,23.09 v68.35,22.78
  Bottom 0.305: v68.35,22.78 68.35,23.06 68.71,23.42 69.37,23.42 69.47,23.52 70.13,23.52 70.48,23.16 74.3,23.16 75.49,24.36 SPI.1
N$3
  Bottom 0.305: R6.1 79.38,31.55 T1.B
N$4
  Bottom 0.305: R11.1 77.38,28.68 T2.B
N$5
  Bottom 0.305: T3.B 79.42,34.53 R12.1
N$6  (via drill 0.5)
  Top 0.305: VCC-MOT.A 85.49,51.69 v86.16,51
  Bottom 0.305: v86.16,51 86.77,48.9 86.67,48.46 86.67,48.34 | 86.67,48.34 86.67,48.28 86.56,48.13 | R5.2 86.74,48.26 86.67,48.34
N$7
  Top 0.305: Q1.1 56.06,37.67 56.59,37.13 56.59,35.1 IC1.20 | 53.66,37.53 Q1.1 | 53.86,37.53 53.87,37.52 53.87,37.59 Q1.1 | C1.1 53.58,37.53 53.67,37.62 53.75,37.62 Q1.1
N$8  (via drill 0.6)
  Top 0.305: v89.13,44.4 89.13,48.49 88.29,49.33 85.62,49.33 VCC-LOGIC.A
  Bottom 0.305: R4.2 87.88,20.04 89.41,21.57 89.41,44.12 v89.13,44.4
N$9  (via drill 0.5)
  Top 0.305: BUS.C 81.92,36.55 v83.57,34.9
  Bottom 0.305: v83.57,34.9 83.57,32.88 T1.C
N$10
  Top 0.305: BUS.A 86.92,37.64 R2.2
N$11
  Top 0.305: R13.2 85.47,45.54 ERROR.A
N$12  (via drill 0.6)
  Top 0.305: v84.15,43.54 83.92,43.54 ERROR.C
  Bottom 0.305: v84.15,43.54 84.05,43.43 84.05,41.12 83.74,40.82 83.74,36.73 83.72,36.73 82.47,35.48 T3.C
N$13  (via drill 0.5)
  Top 0.305: 81.92,41.48 82.17,41.22 83.24,41.22 83.72,40.74 83.72,37.01 84.94,35.79 v85.27,35.79 | 81.92,41.48 81.97,41.48 81.99,41.5 81.89,41.5 81.86,41.53 | STATUS.C 81.92,41.48
  Bottom 0.305: T2.C 80.63,27.3 81.64,26.49 82.96,26.49 84.51,27.84 84.51,35.03 v85.27,35.79
N$14
  Top 0.305: STATUS.A 86.54,41.53 R3.2
N$15  (via drill 0.6)
  Top 0.305: v51.28,54.46 54.2,54.46 54.99,55.24 54.99,57.28 56.52,58.8 72.72,58.8 74.4,57.12 74.4,51.49 74.73,51.16 74.73,48.31 v75.03,48.01 | C3.1 51.19,54.5 51.26,54.43
  Top 0.406: 51.26,54.43 v51.28,54.46
  Bottom 0.305: IC3.7 51.26,54.48 v51.28,54.46 | 75.44,48.21 IC4.3 75.23,48.21 v75.03,48.01 75.13,48.01 75.36,48.23
N$16
  Bottom 0.305: IC4.9 IC4.8 80.55,54.85 R8.2
N$17
  Bottom 0.305: R14.2 75.41,53.35 IC4.7 IC4.6
N$18
  Bottom 0.305: IC4.13 IC4.14 R15.2
N$19  (via drill 0.6)
  Top 0.305: v73.61,50.75 73.58,50.77 73.58,56.87 72.54,57.91 71.55,57.91 71.5,57.96 57.1,57.96 55.85,56.72 55.85,54.43 54.41,52.98 51.84,52.98 49.67,50.81 NTC-BOARD.1
  Bottom 0.305: IC4.5 v73.61,50.75 R18.1 71.83,50.77 71.88,50.77 71.85,50.74
N$20
  Bottom 0.305: IC4.10 80.58,50.77 R19.1 83.82,50.65 83.82,50.77 85.34,52.27 85.34,54.15 84.44,55.01 NTC-MOT.1
N$21
  Bottom 0.305: IC4.2 IC4.1 75.35,44.08 R7.2
N$22
  Bottom 0.305: 80.58,48.23 80.47,48.23 | 80.58,48.23 80.62,48.23 80.7,48.31 80.85,48.31 80.95,48.21 R17.1 R16.2 | 80.58,48.23 IC4.12
N$23  (via drill 0.7)
  Top 0.305: IC1.62 68.87,24.1 69.14,23.82 69.14,23.32 v69.77,22.68
  Bottom 0.305: v69.77,22.68 73,22.68 73.3,22.38 76.02,22.38 SPI.2
N$24  (via drill 0.7)
  Top 0.813: v45.16,71.14 52.53,71.14 54.25,69.32 54.25,65.1 54.18,65.02 ENCODER/ENDSTOP.2
  Bottom 0.406: R27.1 57.15,66.95 57.86,67.67 61.87,67.67 | 61.87,67.67 67.06,67.67 | 67.06,67.67 72.57,67.67 | 72.57,67.67 80.37,67.67 R28.1 | R26.1 72.67,67.56 72.57,67.67 | R25.1 67.13,67.59 67.06,67.67 | R24.1 61.98,67.56 61.87,67.67
  Bottom 0.813: ENC-VCC.2 3.66,27.46 2.13,27.46 1.02,28.57 1.02,66.29 0.86,66.45 0.86,69.01 2.72,70.87 2.85,70.87 3.45,71.27 44.86,71.27 v45.16,71.14 | R27.1 56.19,66.95 ENCODER/ENDSTOP.2
N$25
  Bottom 0.305: U6.5 57.15,11.86 58.5,10.52 61.32,10.52 RS422.3
N$26  (via drill 0.3)
  Top 0.305: RS422.4 58.22,8.48 57.28,8.48 56.62,9.14 56.62,12.22 v56.01,12.83
  Bottom 0.305: v56.01,12.83 54.94,12.83 54.63,13.13 U6.6
N$27
  Bottom 0.305: RS422.5 54.66,7.39 52.7,9.35 52.7,13.59 53.52,14.4 54.43,14.4 54.48,14.35 54.51,14.35 54.56,14.4 U6.7
N$30
  Bottom 0.305: RS422.6 49.66,7.29 51.77,9.4 51.77,14.3 53.11,15.65 54.59,15.65 U6.8
N$31
  Top 0.305: IC1.63 73.75,24.6 74.27,25.12 74.27,25.45 74.75,26.04 74.98,26.11 75.21,26.29 78.66,26.29 SPI.3
N$32
  Top 0.305: IC1.64 73.51,25.1 73.79,25.38 73.84,25.76 74.78,26.8 80.7,26.8 83.13,24.33 83.13,24.36 SPI.4
N$36
  Bottom 0.305: 29.67,12.62 30.79,13.74 32.64,13.74 | 32.79,13.66 32.72,13.74 32.64,13.74 | GPIO.5 GPIO.6 32.64,13.74 | U4.1 40.34,13.23 | 40.34,13.23 40.39,15.24 U3.16 | 35.23,13.72 39.85,13.72 40.34,13.23
  Bottom 0.406: GPIO-LEVEL.2 28.93,8.13 29.39,8.59 29.39,12.29 29.67,12.57 29.67,12.68 30.68,13.69 32.77,13.69 32.79,13.66 | 32.79,13.66 32.69,13.66 | 32.79,13.66 35.18,13.66 35.23,13.72
N$38
  Bottom 0.305: T4.B 5.48,37.2 6.43,38.15 6.43,38.73 7.01,39.32 9.5,39.32 9.68,39.14 R20.1
N$39
  Bottom 0.305: T4.C 7.58,37.42 6.12,35.97 4.83,35.97 4.5,36.3 4.5,36.4 4.37,36.52 4.37,36.88 3.89,37.36 3.22,37.36 FAN.3
OUT1
  Bottom 0.305: GPIO.10 32.59,18.8 33.76,19.96 38.3,19.96 38.89,19.38 41.71,19.38 42.29,19.96 U3.4
OUT2
  Bottom 0.305: U3.5 42.93,19.79 41.91,18.77 GPIO.9
OUT3
  Bottom 0.305: GPIO.7 37.47,16.23 38.89,17.65 43.16,17.65 43.56,17.25 U3.11
OUT4  (via drill 0.5)
  Top 0.305: v37.29,17.75 37.29,17.2 v38.53,15.95
  Bottom 0.305: GPIO.8 32.72,16.23 33.98,17.5 37.03,17.5 v37.29,17.75 | v38.53,15.95 39.14,16.56 39.14,16.54 39.6,16.99 42.34,16.99 42.67,16.66 42.67,16.36 42.29,15.98 U3.13
OUT_1  (via drill 0.3)
  Top 0.305: v58.09,19.99 58.06,21.6 IC1.44 | v48.26,21.34 47.14,21.34 46.81,21.67 42.19,21.67 41.63,22.23 v41.66,22.25
  Bottom 0.305: v48.26,21.34 56.26,21.34 v58.09,19.99 | v41.66,22.25 U3.3
OUT_2  (via drill 0.3)
  Top 0.305: v58.55,22.91 58.57,21.69 IC1.45
  Bottom 0.305: v58.55,22.91 58.06,22.89 49.4,22.86 43.92,22.86 43.56,22.5 U3.6
OUT_3  (via drill 0.3)
  Top 0.305: v59.08,19.43 IC1.46 | IC1.46 | IC1.46 59.08,21.67 | v48.36,19.86 48.36,18.77 46.86,17.27 45.01,17.27 44.4,16.66 v44.2,16.66
  Bottom 0.305: v48.36,19.86 55.8,19.86 57.51,19.02 58.52,19.02 v59.08,19.43 | U3.10 v44.2,16.66
OUT_4  (via drill 0.3, 0.5)
  Top 0.305: v49.4,19.05 47.12,16.76 47.12,15.65 46.56,15.09 42.72,15.09 v41.58,16.23 | IC1.47 59.57,23.04 v59.87,23.34
  Bottom 0.305: v49.4,19.05 55.65,19.05 57.2,18.26 59.23,18.39 59.89,19.07 v59.87,23.34 59.87,22.73 | v41.58,16.23 41.58,15.37 U3.14
PHA  (via drill 0.6)
  Top 0.305: IC1.27 55.65,30.1 55.93,29.82 57.76,29.82 v59.13,31.67 | v73.64,35.56 73.64,44.86 71.55,46.94 71.55,51.13 69.06,53.62 v67.64,53.62
  Bottom 0.305: v59.13,31.67 69.75,31.67 v73.64,35.56 | v67.64,53.62 U7.4
PHB  (via drill 0.6)
  Top 0.305: IC1.29 58.87,29.1 v59.31,29.54 | v72.85,37.44 73.03,37.62 73.03,44.63 70.92,46.74 70.92,50.29 70.1,51.1 67.87,51.1 v67.84,51.08
  Bottom 0.305: v59.31,29.54 62.41,29.54 63.2,30.33 70.36,30.33 73.89,33.86 74.85,33.86 76.45,35.46 76.45,36.91 76.28,37.08 76.25,37.08 75.92,37.41 72.9,37.41 v72.85,37.44 | v67.84,51.08 U7.6 | U7.6 66.29,51.1 | U7.6
PWM
  Top 0.305: IC2.8 20.52,21.61 18.9,19.99 18.09,19.99 U1.5
PWM-3.3  (via drill 0.3, 0.5)
  Top 0.305: IC1.31 56.01,28.1 56.03,28.12 58.01,28.12 v58.34,27.79 | v16.36,19.71 16.71,19.36 18.01,19.36 18.03,19.33 U1.6
  Bottom 0.305: v58.34,27.79 58.14,27.79 57.53,27.18 57,27.18 56.24,26.42 55.88,26.42 53.62,24.16 42.47,24.16 41.94,23.62 33.15,23.62 33.12,23.6 33.07,23.6 27.43,17.96 25.15,17.96 24.97,17.78 18.29,17.78 v16.36,19.71
PWM-FAN  (via drill 0.5)
  Top 0.305: IC1.25 54.62,31.08 54.03,31.09 53.09,30.73 v50.47,30.79
  Bottom 0.305: R20.2 14.17,38.68 16.26,38.68 36.98,38.68 37.08,38.58 38.89,38.58 42.52,42.22 48.62,42.22 51.49,39.34 51.49,34.09 50.47,33.07 v50.47,30.79
RE-RS485  (via drill 0.3)
  Top 0.305: v61.72,19.25 61.57,19.41 61.57,21.59 | 61.57,21.59 61.59,21.61 | IC1.51 61.57,21.59
  Bottom 0.305: IC6.2 64.44,18.09 64.06,18.47 62.51,18.47 v61.72,19.25
RESET  (via drill 0.6)
  Top 0.305: IC1.14 59.57,36.12 v58.04,37.64 58.04,38.15 57.63,38.56 57.63,42.14 57.99,42.49 57.99,43.71 58.34,44.07 59.41,44.07 | JTAG.4 59.54,44.04 | 59.44,44.04 59.26,44.04 | 59.41,44.07 59.51,44.07 59.54,44.04 | 59.54,44.04 59.44,44.04 | 59.44,44.04 59.41,44.07
  Bottom 0.305: v58.04,37.64 57.1,37.64 56.57,37.11 R29.2
RS422-RX  (via drill 0.6)
  Top 0.305: v62.26,14.4 66.19,14.4 67.44,15.65 67.44,18.06 65.58,19.91 65.58,21.6 IC1.59
  Bottom 0.305: U6.2 v62.26,14.4
RS422-TX  (via drill 0.6)
  Top 0.305: IC1.60 66.07,20.24 67.92,18.39 67.92,15.29 66.57,13.95 63.12,13.95 62.51,13.34 62.31,13.34 v61.92,12.95
  Bottom 0.305: v61.92,12.95 61.37,12.95 61.19,13.13 59.99,13.13 59.97,13.16 U6.3
RS485-A  (1 unrouted)
  Top 0.305: B-B-R.4 79.65,11.18 77.11,11.18 74.7,8.76 RS422.1 74.65,7.09 74.65,2.72 72.77,0.84 12.75,0.84 11.66,1.93 9.04,1.93 8.23,2.74 8.23,9.37 7.82,9.78 7.82,9.8 6.5,11.12 4.39,11.12 3.15,12.37 B-B-L.4
  Bottom 0.305: IC6.6 65.71,10.59 66.93,9.37 68,9.37 68.48,9.86 72.24,9.86 73.03,9.07 73.03,8.79 74.68,7.14
RS485-B
  Top 0.305: B-B-R.3 74.98,12.42 RS422.2 69.72,7.11 69.72,3.45 67.72,1.45 12.98,1.45 11.86,2.56 9.27,2.56 8.84,3 8.84,9.63 6.1,12.37 B-B-L.3
  Bottom 0.305: RS422.2 67.89,7.14 64.47,10.57 64.47,11.78 IC6.7
RSTOUT
  Top 0.305: IC1.11 61.07,36.77 60.48,37.36 60.02,37.36 59.66,37.72 59.66,39.12 59.46,39.32 59.46,41.5 59.97,42.01 JTAG.2
RX-RS485  (via drill 0.3)
  Top 0.305: v55.73,24.59 54.6,24.59 IC1.38
  Bottom 0.305: IC6.1 62.7,17 61.06,18.64 61.06,22.33 | 61.06,22.38 61.29,22.61 | v55.73,24.59 55.65,24.56 56.03,24.18 60.27,24.18 61.29,23.16 61.29,22.58 61.06,22.35 | 61.06,22.35 61.04,22.38 61.06,22.38 | 61.06,22.38 61.06,22.35 | 61.06,22.35 61.09,22.33 61.06,22.33 | 61.06,22.33 61.06,22.35
SDA_EEPROM
  Top 0.305: IC5.3 47.11,24.94 R23.2 47.47,25.17 48.21,24.43 49.58,24.43 49.91,24.11 IC1.39
SENSE-NTCBOARD  (via drill 0.5)
  Top 0.305: IC1.6 63.57,36.39 65,37.87 66.09,37.87 v66.24,37.97
  Bottom 0.305: R8.1 82.4,56.8 82.42,56.82 82.42,56.72 82.47,56.67 82.47,56.73 C20.1 82.4,56.81 82.4,58.7 82.07,59.03 79.78,59.03 77.95,57.2 77.95,41.94 76.76,40.74 70.84,40.74 69.6,39.5 67.74,39.5 66.24,38 v66.24,37.97
SENSE-NTCMOT  (via drill 0.6)
  Top 0.305: IC1.7 63.07,36.93 v63.6,37.62
  Bottom 0.305: C21.1 73.52,54.83 R14.1 | v63.6,37.62 64.03,37.85 67.36,41.17 69.14,41.17 71.48,43.51 71.48,44.42 72.69,45.64 72.69,47.83 73.69,48.82 76.63,48.82 77.27,49.45 77.27,57 75.74,58.52 73.91,58.52 73.69,58.29 73.69,56.74 | 73.69,56.74 73.41,56.46 | C21.1 73.61,56.79 73.66,56.84 73.66,56.74 | 73.69,56.74 73.57,56.74 C21.1
SENSE-VMOT  (via drill 0.6)
  Top 0.305: IC1.17 58.07,34.16 v58.6,33.63
  Bottom 0.305: R15.1 82.49,44.08 C22.1 82.53,42.3 82.53,40.77 81.89,40.13 71.14,40.13 69.88,38.86 68.02,38.86 67.39,38.23 67.39,37.85 66.5,36.96 64.95,36.96 62.87,34.87 59.31,34.87 58.6,34.16 v58.6,33.63
SPEED-FAN  (via drill 0.5)
  Top 0.305: v47.22,31.06 48.49,31.14 50.16,29.59 IC1.28
  Bottom 0.305: 6.22,35.05 9.14,37.97 39.17,37.97 42.62,41.43 48.56,41.43 50.88,39.12 50.88,34.72 v47.22,31.06 | FAN.1 6.22,35.05 | R21.2 6.58,34.72 6.27,35.03 | 6.25,35.05 6.27,35.03 | 6.27,35.03 6.24,35.03 6.22,35.05
TCK
  Top 0.305: IC1.5 64.07,36.2 65.18,37.31 65.89,37.31 65.94,37.26 66.73,37.26 67.13,37.67 67.13,38.3 64.72,40.72 64.72,41 | 64.72,41 64.77,41.05 | 64.72,41 JTAG.1
TDI
  Top 0.305: IC1.2 65.57,36.1 65.73,36.27 67.69,36.27 68.28,36.85 68.81,36.85 69.16,37.16 69.16,38.05 68.94,38.23 68.94,38.94 67.59,40.28 67.59,45.49 66.02,47.07 64.8,47.07 JTAG.7
TDO
  Top 0.305: IC1.1 66.07,35.13 66.65,35.71 67.87,35.71 68.5,36.35 69.04,36.35 69.49,36.8 69.49,36.83 69.67,36.93 69.67,38.25 69.39,38.46 69.39,39.17 68.17,40.39 68.17,46.46 66.8,47.83 66.8,48.18 65.86,49.12 JTAG.9
TMS  (via drill 0.5, 0.6)
  Top 0.305: IC1.3 65.07,33.82 v65.05,33.81 | v68.43,37.59 68.43,38.76 66.95,40.23 66.95,42.88 JTAG.5 64.8,45.03
  Bottom 0.305: v65.05,33.81 65.05,35.87 65.53,36.35 67.18,36.35 v68.43,37.59
TRST
  Top 0.305: IC1.4 64.57,36.02 65.33,36.78 67.06,36.78 67.69,37.41 67.69,38.56 66.34,39.9 66.34,42.55 65.86,43.03 JTAG.3 64.82,43.03
TX-RS485  (via drill 0.3)
  Top 0.305: IC1.37 55.32,25.1 55.63,25.4 56.06,25.4 v56.41,25.04
  Bottom 0.305: IC6.4 66.98,18.49 66.29,19.18 65.84,19.18 65.46,19.56 63.42,19.56 63.02,19.96 63.02,20.3 62.08,21.23 62.08,22.45 62.05,22.48 62.05,23.22 60.15,25.12 56.49,25.12 v56.41,25.04

## Text on the board
bPlace: Novembre 2013 | MotorPR-V1.0
tNames: MOT1 | MOT2 | MotGND | MotVCC | GND | VCC | END-2 | END-1 | INDEX | PHA | PHB | 5V | 12V | A | +5V | A | B | Z | Y | B | +12V | GND | 5V | 12V | RS485